# Altium schematic sheet Blackbox-h743-bga.SchDoc
size A4
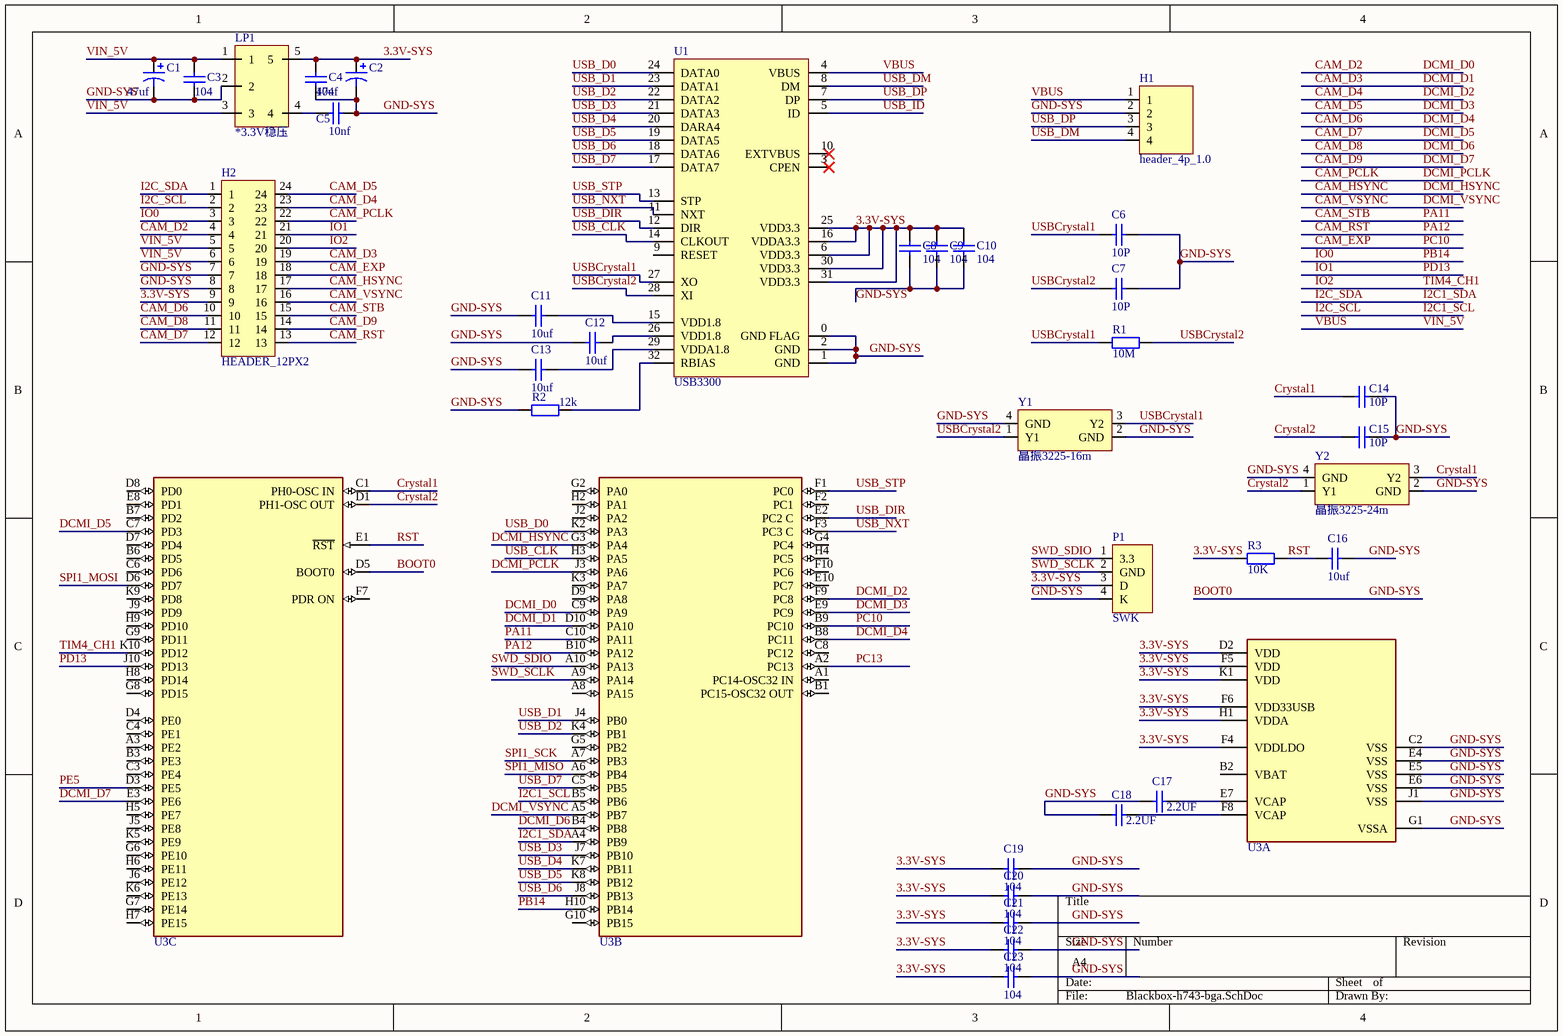
[diagram p0: Blackbox-h743-bga.SchDoc]

## Parts
C1  47uf  [0805_C]
C2  47uf  [0805_C]
C3  value 104  [C0402]  (hidden comment: Cap)
C4  value 104  [C0402]  (hidden comment: Cap)
C5  value 10nf  [C0402]  (hidden comment: Cap)
C6  value 10P  [C0402]  (hidden comment: Cap)
C7  value 10P  [C0402]  (hidden comment: Cap)
C8  104  [C0402]
C9  104  [C0402]
C10  104  [C0402]
C11  10uf  [C0402]
C12  10uf  [C0402]
C13  10uf  [C0402]
C14  value 10P  [C0402]  (hidden comment: Cap)
C15  value 10P  [C0402]  (hidden comment: Cap)
C16  10uf  [C0402]
C17  value 2.2UF  [C0402]  (hidden comment: Cap)
C18  value 2.2UF  [C0402]  (hidden comment: Cap)
C19  value 104  [C0402]  (hidden comment: Cap)
C20  value 104  [C0402]  (hidden comment: Cap)
C21  value 104  [C0402]  (hidden comment: Cap)
C22  value 104  [C0402]  (hidden comment: Cap)
C23  value 104  [C0402]  (hidden comment: Cap)
H1  header_4p_1.0  [header4p_1.0_mini]
H2  HEADER_12PX2  [松下AXE-24PIN-0.4mm-socket]
LP1  *3.3V稳压  [SOT23-5]
P1  SWK  [header4p_1.0_mini]
R1  10M  [R0402]
R2  value 12k  [R0402]  (hidden comment: Res2)
R3  10K  [R0402]
U1  USB3300  [USB3300]
U3  STM32H743VIH6  [STMicroelectronics_TFBGA100-A08Q_MFG]  (value not drawn)  (parts A,B,C of 3)
Y1  晶振3225-16m  [X3225]
Y2  晶振3225-24m  [X3225]

## Nets
3.3V-SYS: C2.1 C4.1 C8.1 C9.1 C10.1 C19.2 C20.2 C21.2 C22.2 C23.2 H2.9 LP1.5 P1.3(D) R3.1 U1.6(VDD3.3) U1.16(VDDA3.3) U1.25(VDD3.3) U1.30(VDD3.3) U1.31(VDD3.3) U3.D2(VDD) U3.F4(VDDLDO) U3.F5(VDD) U3.F6(VDD33USB) U3.H1(VDDA) U3.K1(VDD)
BOOT0: C1.2 C2.2 C3.1 C4.2 C5.1 C6.2 C7.2 C8.2 C9.2 C10.2 C11.2 C12.2 C13.2 C14.1 C15.1 C16.1 C17.2 C18.2 C19.1 C20.1 C21.1 C22.1 C23.1 H1.2 H2.7 H2.8 LP1.2 P1.4(K) R2.2 U1.0(GND_FLAG) U1.1(GND) U1.2(GND) U3.C2(VSS) U3.D5(BOOT0) U3.E4(VSS) U3.E5(VSS) U3.E6(VSS) U3.G1(VSSA) U3.J1(VSS) Y1.2(GND) Y1.4(GND) Y2.2(GND) Y2.4(GND)  [also labelled GND-SYS]
CAM_D2: H2.4 U3.C9(PA9)  [also labelled DCMI_D0]
CAM_D3: H2.19 U3.D10(PA10)  [also labelled DCMI_D1]
CAM_D4: H2.23 U3.F9(PC8)  [also labelled DCMI_D2]
CAM_D5: H2.24 U3.E9(PC9)  [also labelled DCMI_D3]
CAM_D6: H2.10 U3.B8(PC11)  [also labelled DCMI_D4]
CAM_D7: H2.12 U3.C7(PD3)  [also labelled DCMI_D5]
CAM_D8: H2.11 U3.B4(PB8)  [also labelled DCMI_D6]
CAM_D9: H2.14 U3.E3(PE6)  [also labelled DCMI_D7]
CAM_EXP: H2.18 U3.B9(PC10)  [also labelled PC10]
CAM_HSYNC: H2.17 U3.G3(PA4)  [also labelled DCMI_HSYNC]
CAM_PCLK: H2.22 U3.J3(PA6)  [also labelled DCMI_PCLK]
CAM_RST: H2.13 U3.B10(PA12)  [also labelled PA12]
CAM_STB: H2.15 U3.C10(PA11)  [also labelled PA11]
CAM_VSYNC: H2.16 U3.A5(PB7)  [also labelled DCMI_VSYNC]
Crystal1: C14.2 U3.C1(PH0-OSC_IN) Y2.3(Y2)
Crystal2: C15.2 U3.D1(PH1-OSC_OUT) Y2.1(Y1)
I2C1_SCL: H2.2 U3.B5(PB6)  [also labelled I2C_SCL]
I2C1_SDA: H2.1 U3.A4(PB9)  [also labelled I2C_SDA]
IO0: H2.3 U3.H10(PB14)  [also labelled PB14]
IO1: H2.21 U3.J10(PD13)  [also labelled PD13]
IO2: H2.20 U3.K10(PD12)  [also labelled TIM4_CH1]
PC13: U3.A2(PC13)
PE5: U3.D3(PE5)
RST: C16.2 R3.2 U3.E1(~{RST})
SPI1_MISO: U3.A6(PB4)
SPI1_MOSI: U3.D6(PD7)
SPI1_SCK: U3.A7(PB3)
SWD_SCLK: P1.2(GND) U3.A9(PA14)
SWD_SDIO: P1.1(3.3) U3.A10(PA13)
USB_CLK: U1.14(CLKOUT) U3.H3(PA5)
USB_D0: U1.24(DATA0) U3.K2(PA3)
USB_D1: U1.23(DATA1) U3.J4(PB0)
USB_D2: U1.22(DATA2) U3.K4(PB1)
USB_D3: U1.21(DATA3) U3.J7(PB10)
USB_D4: U1.20(DARA4) U3.K7(PB11)
USB_D5: U1.19(DATA5) U3.K8(PB12)
USB_D6: U1.18(DATA6) U3.J8(PB13)
USB_D7: U1.17(DATA7) U3.C5(PB5)
USB_DIR: U1.12(DIR) U3.E2(PC2_C)
USB_DM: H1.4 U1.8(DM)
USB_DP: H1.3 U1.7(DP)
USB_ID: U1.5(ID)
USB_NXT: U1.11(NXT) U3.F3(PC3_C)
USB_STP: U1.13(STP) U3.F1(PC0)
USBCrystal1: C6.1 R1.1 U1.27(XO) Y1.3(Y2)
USBCrystal2: C7.1 R1.2 U1.28(XI) Y1.1(Y1)
VBUS: C1.1 C3.2 H1.1 H2.5 H2.6 LP1.1 LP1.3 U1.4(VBUS)  [also labelled VIN_5V]
NetC5_2: C5.2 LP1.4
NetC11_1: C11.1 U1.15(VDD1.8)
NetC12_1: C12.1 U1.26(VDD1.8)
NetC13_1: C13.1 U1.29(VDDA1.8)
NetC17_1: C17.1 U3.E7(VCAP)
NetC18_1: C18.1 U3.F8(VCAP)
NetR2_1: R2.1 U1.32(RBIAS)

Not connected (* = marked no-connect by the designer): U1 3(CPEN)* 9(RESET) 10(EXTVBUS)*; U3 A1(PC14-OSC32_IN) A3(PE2) A8(PA15) B1(PC15-OSC32_OUT) B2(VBAT) B3(PE3) B6(PD5) B7(PD2) C3(PE4) C4(PE1) C6(PD6) C8(PC12) D4(PE0) D7(PD4) D8(PD0) D9(PA8) E8(PD1) E10(PC7) F2(PC1) F7(PDR_ON) F10(PC6) G2(PA0) G4(PC4) G5(PB2) G6(PE10) G7(PE14) G8(PD15) G9(PD11) G10(PB15) H2(PA1) H4(PC5) H5(PE7) H6(PE11) H7(PE15) H8(PD14) H9(PD10) J2(PA2) J5(PE8) J6(PE12) J9(PD9) K3(PA7) K5(PE9) K6(PE13) K9(PD8)

## Library data of the parts
C1 C2 = cap_pn
C3-C7 C14 C15 C17-C23 = Cap: Capacitor; Published: 8-Jun-2000; LatestRevisionDate: 17-Jul-2002; LatestRevisionNote: Re-released for DXP Platform.; PackageReference: RAD-0.3; Publisher: Altium Limited
  C3-C7 C14 C15 C19-C23: PackageDescription: Radial Cap, Thru-Hole; 2 Leads; 0.3 in Pin Spacing
C8-C13 C16 = CAP
LP1 = LP2985
P1 = SWD_4P
R1 R3 = RES
R2 = Res2: Resistor; Published: 8-Jun-2000; LatestRevisionDate: 17-Jul-2002; LatestRevisionNote: Re-released for DXP Platform.; PackageReference: AXIAL-0.4; Publisher: Altium Limited; PackageDescription: Axial Device, Thru-Hole; 2 Leads; 0.4 in Pin Spacing
Y1 Y2 = 晶振3225